# EAGLE design EVSE_Arduino_Shield (EAGLE 9.6.2)
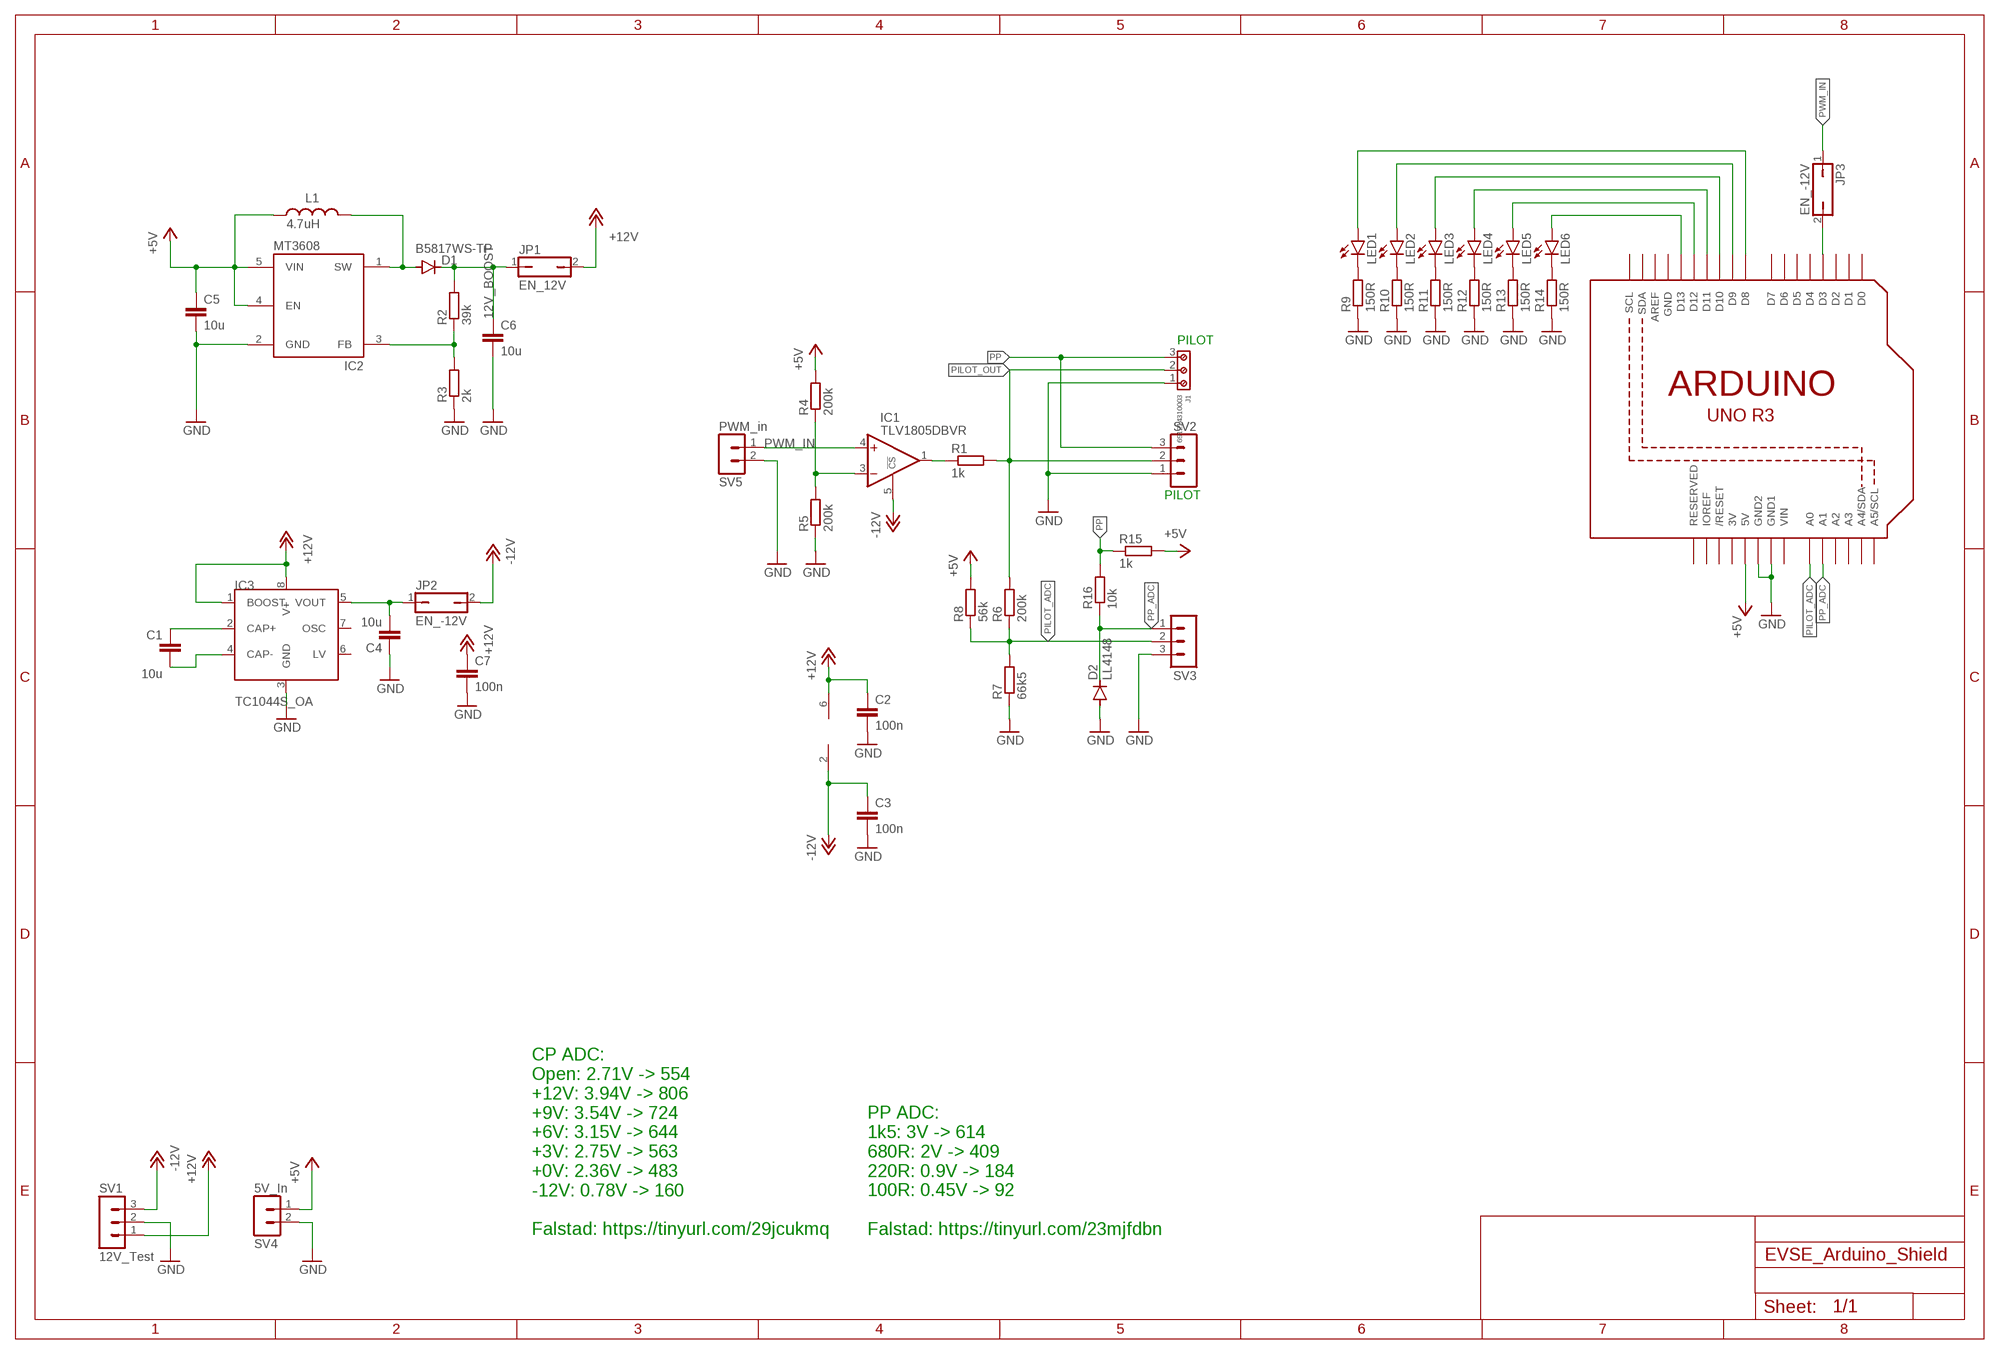
[diagram p0: schematic, sheet 1]

## Parts
C1  10u  C-EUC0805  [C0805]
C2  100n  C-EUC0603  [C0603]
C3  100n  C-EUC0603  [C0603]
C4  10u  C-EUC0805  [C0805]
C5  10u  C-EUC0805  [C0805]
C6  10u  C-EUC0805  [C0805]
C7  100n  C-EUC0603  [C0603]
D1  B5817WS-TP  DIODE-SOD323-R  [SOD323-R]
D2  LL4148  DIODE-SOD80C  [SOD80C]
IC1  TLV1805DBVR  [SOT23-6]
IC2  MT3608  [SOT23-6]
IC3  TC1044S_OA  [SO08]
J1  691214310003  [691214310003]
JP1  EN_12V  JP1Q  [JP1]
JP2  EN_-12V  JP1Q  [JP1]
JP3  EN_-12V  JP1Q  [JP1]
L1  4.7uH  WE-PMI_0805_74479775247_H1  [WE-PMI_0805_H1]
LED1  LEDCHIP-LED0603  [CHIP-LED0603]
LED2  LEDCHIP-LED0603  [CHIP-LED0603]
LED3  LEDCHIP-LED0603  [CHIP-LED0603]
LED4  LEDCHIP-LED0603  [CHIP-LED0603]
LED5  LEDCHIP-LED0603  [CHIP-LED0603]
LED6  LEDCHIP-LED0603  [CHIP-LED0603]
R1  1k  R-EU_R0805  [R0805]
R2  39k  R-EU_R0603  [R0603]
R3  2k  R-EU_R0603  [R0603]
R4  200k  R-EU_R0603  [R0603]
R5  200k  R-EU_R0603  [R0603]
R6  200k  R-EU_R0603  [R0603]
R7  66k5  R-EU_R0603  [R0603]
R8  56k  R-EU_R0603  [R0603]
R9  150R  R-EU_R0603  [R0603]
R10  150R  R-EU_R0603  [R0603]
R11  150R  R-EU_R0603  [R0603]
R12  150R  R-EU_R0603  [R0603]
R13  150R  R-EU_R0603  [R0603]
R14  150R  R-EU_R0603  [R0603]
R15  1k  R-EU_R0603  [R0603]
R16  10k  R-EU_R0603  [R0603]
SV1  12V_Test  MA03-1  [MA03-1]
SV2  MA03-1  [MA03-1]
SV3  MA03-1  [MA03-1]
SV4  5V_In  MA02-1  [MA02-1]
SV5  PWM_in  MA02-1  [MA02-1]
U2  ARDUINOR3-DIMENSION  [ARDUINOR3]

## Nets
12V_BOOST: C6.1 D1.C JP1.1 R2.2
+5V: C5.1 IC2.4(EN) IC2.5(VIN) L1.1 R4.2 R8.2 R15.2 SV4.1 U2.5V
+12V: C2.1 C7.1 IC1.6(V+) IC3.1(BOOST) IC3.8(V+) JP1.2 SV1.1
-12V: C3.1 IC1.2(V-) IC1.5(!CS) JP2.2 SV1.3
BOOST_SW: D1.A IC2.1(SW) L1.2
GND: C2.2 C3.2 C4.1 C5.2 C6.2 C7.2 D2.A IC2.2(GND) IC3.3(GND) J1.1 R3.1 R5.1 R7.1 R9.1 R10.1 R11.1 R12.1 R13.1 R14.1 SV1.2 SV2.1 SV3.3 SV4.2 SV5.2 U2.GND1 U2.GND2
N$1: LED1.C R9.2
N$2: LED2.C R10.2
N$3: IC2.3(FB) R2.1 R3.2
N$4: IC1.1(OUT) R1.1
N$5: JP3.2 U2.D3
N$6: LED3.C R11.2
N$7: C4.2 IC3.5(VOUT) JP2.1
N$8: IC1.3(-IN) R4.1 R5.2
N$9: LED4.C R12.2
N$10: LED5.C R13.2
N$11: C1.1 IC3.2(CAP+)
N$12: C1.2 IC3.4(CAP-)
N$13: LED6.C R14.2
N$14: LED6.A U2.D13
N$15: LED5.A U2.D12
N$16: LED4.A U2.D11
N$17: LED3.A U2.D10
N$18: LED2.A U2.D9
N$19: LED1.A U2.D8
PILOT_ADC: R6.1 R7.2 R8.1 SV3.2 U2.A0
PILOT_OUT: J1.2 R1.2 R6.2 SV2.2
PP: J1.3 R15.1 R16.2 SV2.3
PP_ADC: D2.C R16.1 SV3.1 U2.A1
PWM_IN: IC1.4(+IN) JP3.1 SV5.1
Unconnected: IC3.6(LV) IC3.7(OSC) U2.A2 U2.A3 U2.A4(A4/SDA) U2.A5(A5/SCL) U2.AREF U2.D0 U2.D1 U2.D2 U2.D4 U2.D5 U2.D6 U2.D7 U2.IOREF U2.RESERVED U2.RESET(/RESET) U2.SCL U2.SDA

## Notes on the sheet
- PILOT
- PILOT
- CP ADC:
  Open: 2.71V -> 554
  +12V: 3.94V -> 806
  +9V: 3.54V -> 724
  +6V: 3.15V -> 644
  +3V: 2.75V -> 563
  +0V: 2.36V -> 483
  -12V: 0.78V -> 160
  
  Falstad: https://tinyurl.com/29jcukmq
- PP ADC:
  1k5: 3V -> 614
  680R: 2V -> 409
  220R: 0.9V -> 184
  100R: 0.45V -> 92
  
  Falstad: https://tinyurl.com/23mjfdbn

## Power pins joined to a net without a drawn wire
3V: U2.3V
GND: U2.GND
VIN: U2.VIN

## Library data of the parts
C1-C7 = rcl:C-EU: CAPACITOR, European symbol; SPICEPREFIX: C
D1 D2 = diode:DIODE-: DIODE
IC1 = Eigene-Rietig:TLV1805DBVR
IC2 = Eigene-Rietig:MT3608
IC3 = TC1044S:TC1044S
J1 = Wurth_Connectors_WR-TBL Rising Cage Clamp:691214310003: WR-TBL Serie 2143 - 3.81 mm Horiz. Entry Modular KIND PROPERTIES Pitch 3.81 mm MATERIAL PROPERTIES Insulator Material PA66 Insulator Flammability Rating UL94 V-0 Insulator Color Green Contact Material Brass Contact Plating Copper over Zinc Terminal Screw Material Steel Terminal Screw Plating Zinc Wire Guard Material Brass GENERAL INFORMATION Operating Temperature -40 up to +105 °C Compliance Lead free / RoHS ELECTRICAL PROPERTIES IR cULus 10 A Working Voltage [cULus] 300 V (AC) Withstanding Voltage [cULus] 1600 V (AC) Contact Resistance [cULus] 20 mΩ MECHANICAL PROPERTIES Wire Strip Length 5 up to 6 (mm) Screw M2 Solid Wire Section (AWG) 24 to 16 (AWG) Solid Wire Section (Metric) 0.205 to 1.31 (mm²) Stranded Wire Section (AWG) 24 to 16 (AWG) Stranded Wire Section (Metric) 0.205 to 1.31 (mm²) CERTIFICATION cULus Approval E315414 PACKAGING PROPERTIES Packaging Box <https://katalog.we-online.com/media/images/v2/o33236v209%20Family_WR-TBL_69121431000x.jpg> Details see: https://katalog.we-online.com/en/em/TBL_3_81_2143_HORIZONTAL_ENTRY_MODULAR_69121431000X Updated by Ella Wu 2019-11-13 2019(C) Wurth Elektronik; DATASHEET-URL: https://www.we-online.com/redexpert/spec/691214310003?ae; IR-UL: 10A; MOUNT: THT; PART-NUMBER: 691214310003; PINS: 3; PITCH: 3.81mm; TYPE: Horizontal; WIRE: 24 to 16 (AWG) 0.205 to 1.31 (mm²); WORKING-VOLTAGE-UL: 300V (AC)
JP1-JP3 = jumper:JP1Q: JUMPER
L1 = Wurth_Power Magnetics_WE-PMI:WE-PMI_0805: WE-PMI Power Multilayer Inductor Shielded Characteristics Compact multilayer type Suitable for applications with high currents up to 2.7 A Smallest RDC-Values starting at 7 mΩ Magnetically shielded construction: No crosstalk Operating temperature: –40 °C to +125 °C Recommended soldering profile: Reflow 4 sizes and 3 different types available (Low Profile, Low RDC & High Saturation Current) Applications DC/DC converters especially at high switching frequencies > 1MHz Electronic devices with very low profile Portable devices like Smart Phones, Tablets, Notebooks and Digital Cameras <https://www.we-online.com/catalog/media/o14838v209%20Family_WE-PMI.jpg> Details see: https://www.we-online.com/katalog/en/WE-PMI Updated by Ella Wu 2020-12-17 2020 (C) Wurth Elektronik; DATASHEET-URL: https://www.we-online.com/catalog/datasheet/74479775247.pdf; FRES: 30MHz; H: 1mm; IR1: 600mA; IR2: 850mA; ISAT: 250mA; PART-NUMBER: 74479775247; RDC: 250mOhm; TYPE: Low RDC
LED1-LED6 = led:LED: LED OSRAM: - CHIPLED LG R971, LG N971, LY N971, LG Q971, LY Q971, LO R971, LY R971 LH N974, LH R974 LS Q976, LO Q976, LY Q976 LO Q996 - Hyper CHIPLED LW Q18S LB Q993, LB Q99A, LB R99A - SideLED LS A670, LO A670, LY A670, LG A670, LP A670 LB A673, LV A673, LT A673, LW A673 LH A674 LY A675 LS A676, LA A676, LO A676, LY A676, LW A676 LS A679, LY A679, LG A679 - Hyper Micro SIDELED® LS Y876, LA Y876, LO Y876, LY Y876 LT Y87S - SmartLED LW L88C, LW L88S LB L89C, LB L89S, LG L890 LS L89K, LO L89K, LY L89K LS L896, LA L896, LO L896, LY L896 - TOPLED LS T670, LO T670, LY T670, LG T670, LP T670 LSG T670, LSP T670, LSY T670, LOP T670, LYG T670 LG T671, LOG T671, LSG T671 LB T673, LV T673, LT T673, LW T673 LH T674 LS T676, LA T676, LO T676, LY T676, LB T676, LH T676, LSB T676, LW T676 LB T67C, LV T67C, LT T67C, LS T67K, LO T67K, LY T67K, LW E67C LS E67B, LA E67B, LO E67B, LY E67B, LB E67C, LV E67C, LT E67C LW T67C LS T679, LY T679, LG T679 LS T770, LO T770, LY T770, LG T770, LP T770 LB T773, LV T773, LT T773, LW T773 LH T774 LS E675, LA E675, LY E675, LS T675 LS T776, LA T776, LO T776, LY T776, LB T776 LHGB T686 LT T68C, LB T68C - Hyper Mini TOPLED® LB M676 - Mini TOPLED Santana® LG M470 LS M47K, LO M47K, LY M47K Source: http://www.osram.convergy.de LUXEON: - LUMILED® LXK2-PW12-R00, LXK2-PW12-S00, LXK2-PW14-U00, LXK2-PW14-V00 LXK2-PM12-R00, LXK2-PM12-S00, LXK2-PM14-U00 LXK2-PE12-Q00, LXK2-PE12-R00, LXK2-PE12-S00, LXK2-PE14-T00, LXK2-PE14-U00 LXK2-PB12-K00, LXK2-PB12-L00, LXK2-PB12-M00, LXK2-PB14-N00, LXK2-PB14-P00, LXK2-PB14-Q00 LXK2-PR12-L00, LXK2-PR12-M00, LXK2-PR14-Q00, LXK2-PR14-R00 LXK2-PD12-Q00, LXK2-PD12-R00, LXK2-PD12-S00 LXK2-PH12-R00, LXK2-PH12-S00 LXK2-PL12-P00, LXK2-PL12-Q00, LXK2-PL12-R00 Source: www.luxeon.com KINGBRIGHT: KA-3528ASYC Source: www.kingbright.com
R1-R16 = rcl:R-EU_: RESISTOR, European symbol; SPICEPREFIX: R
SV1-SV3 = con-lstb:MA03-1: PIN HEADER; OC_FARNELL: unknown; OC_NEWARK: unknown
SV4 SV5 = Eigene-Rietig:MA02-1: PIN HEADER; OC_FARNELL: unknown; OC_NEWARK: unknown
U2 = adafruit:ARDUINOR3: This is a new object for the new Arduino R3 - with extra pins that you may want to use (such as IOref, and duplicated A4/A5

## Net classes
1 power: width 0.406 mm

## Board
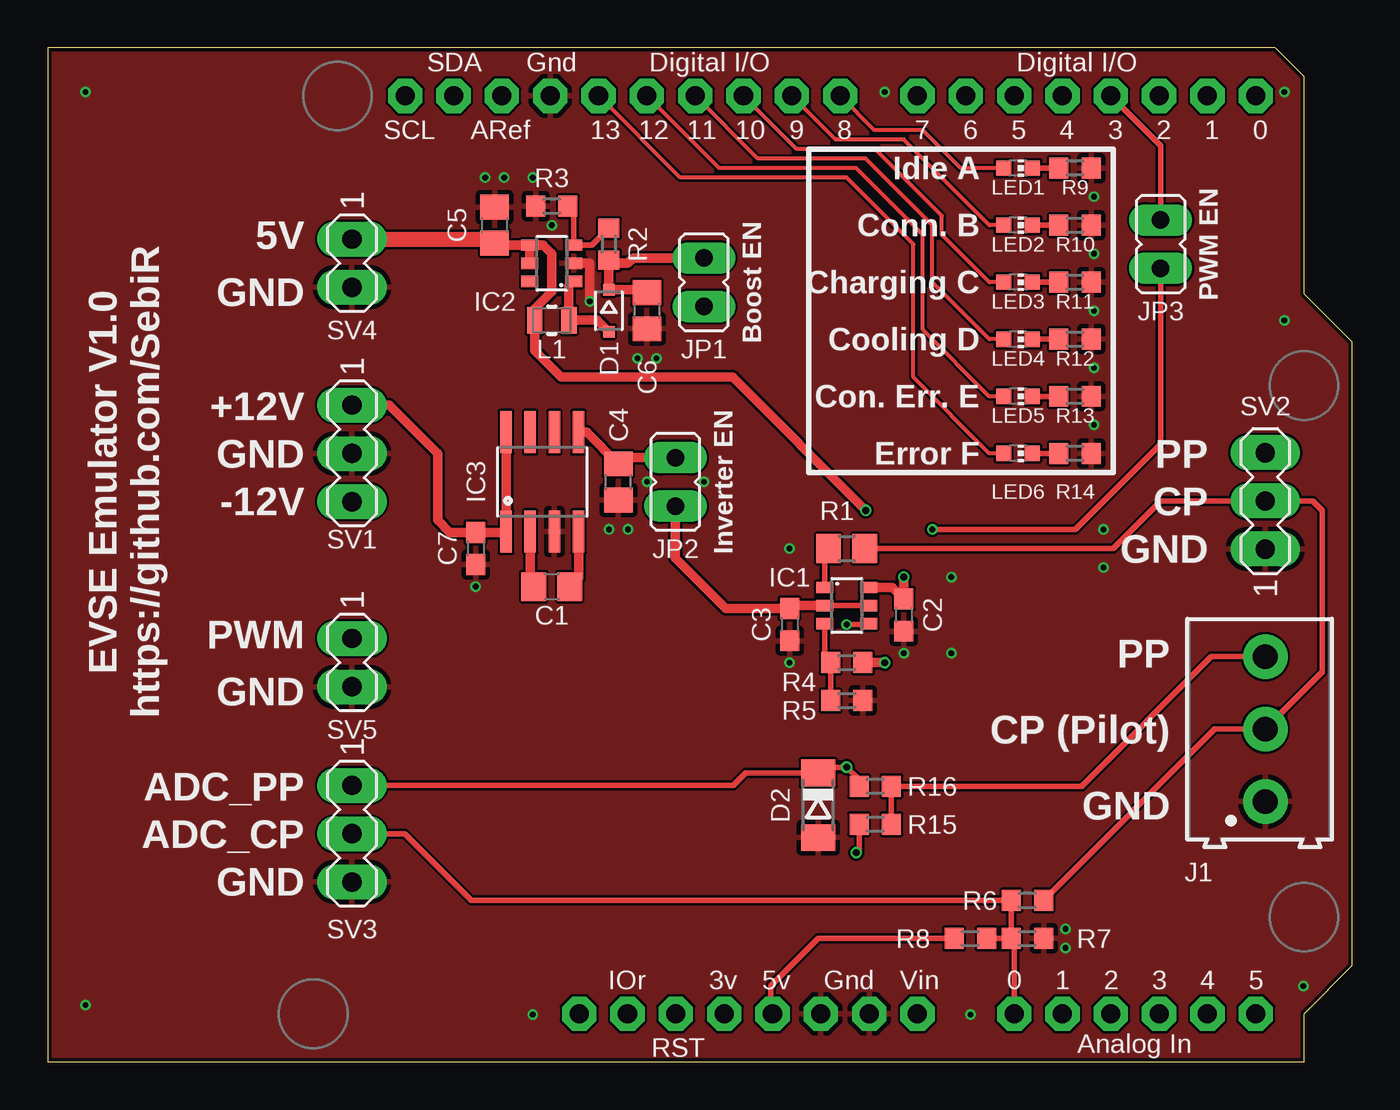
[diagram p1: board, top side]
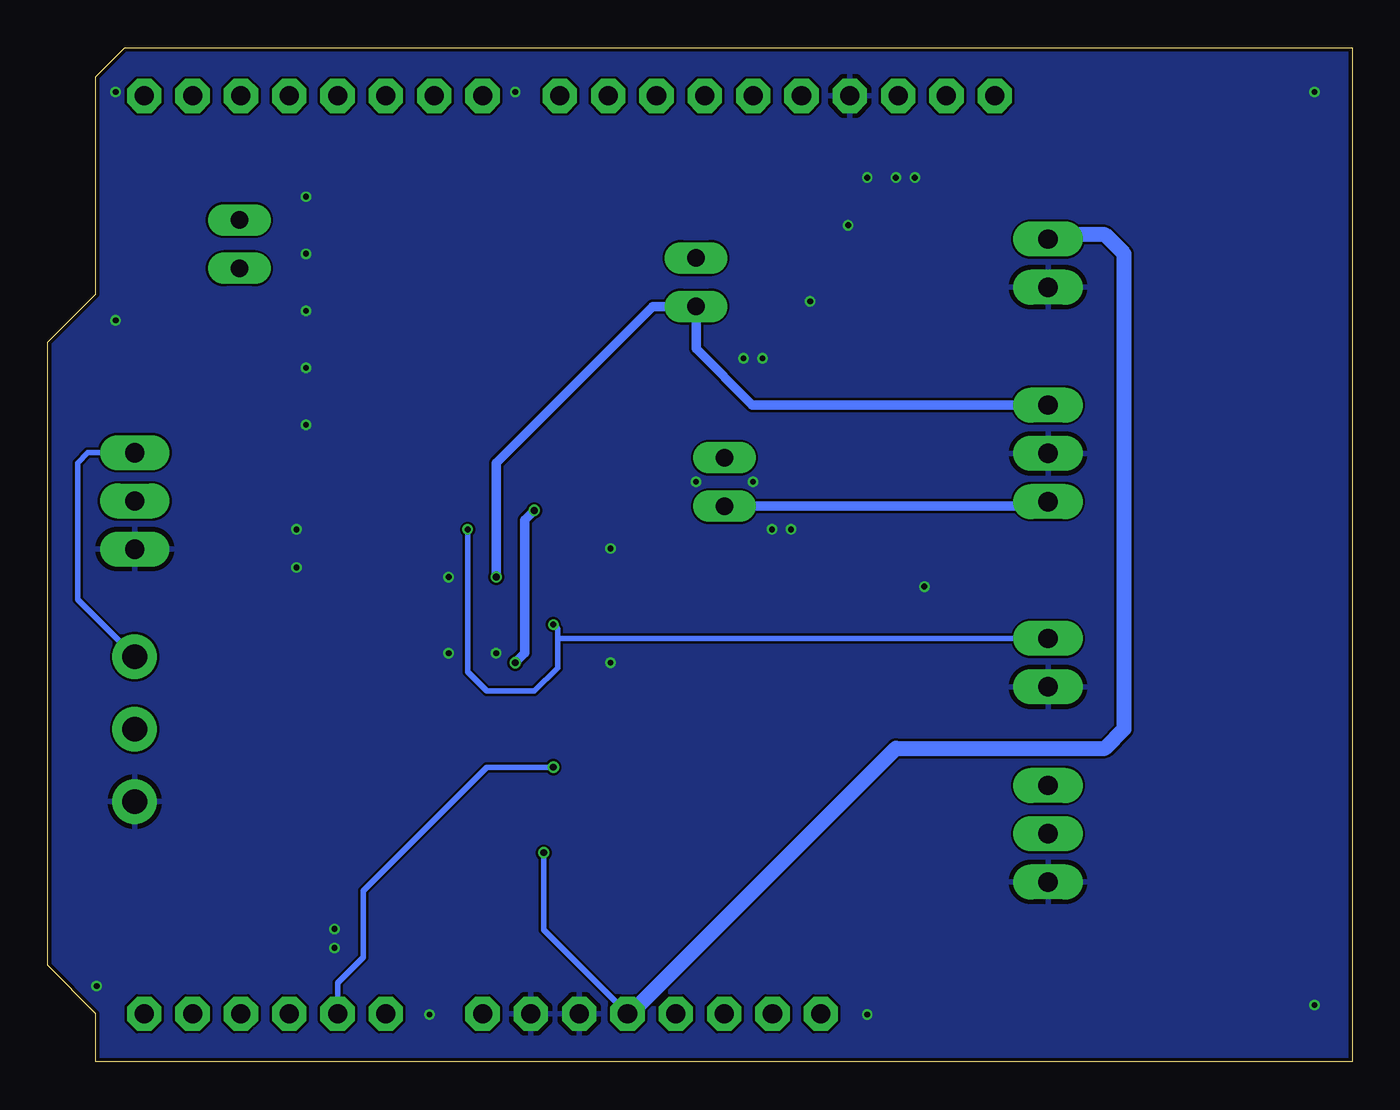
[diagram p2: board, bottom side, seen from below]

Size 68.58 x 53.34 mm. Coordinates in mm from the lower left corner, seen from the top.
Copper layers (1*16): Top 0.035mm / dielectric 1.6mm / Bottom 0.035mm
Design rules "jlcpcb-2layers": minimum track width 0.2mm, minimum drill 0.3mm, track to track 5mil, track to pad 5mil, pad to pad 5mil, via to via 5mil, smd to smd 5mil, copper to edge 0.2mm, drill to drill 6mil, minimum pad ring 10mil, minimum via ring 0.125mm, stop-mask expansion 4mil, vias tented up to drill 0.5mm, thermal gap 10mil

### Footprints (pad centres in the part's own frame; a part is rotated, then mirrored left to right if it is on the bottom)
C0805 = smd 1.3 x 1.5: 1 -0.95,0; 2 0.95,0
C0603 = smd 1.1 x 1: 1 -0.85,0; 2 0.85,0
SOD323-R = smd 0.6 x 0.6: A 1.1,0; C -1.1,0
SOD80C = smd 1.4 x 1.8: A 1.7,0; C -1.7,0
SOT23-6 = smd 0.6 x 0.9: 1 -0.95,-1.15; 2 0,-1.15; 3 0.95,-1.15; 4 0.95,1.15; 5 0,1.15; 6 -0.95,1.15
SO08 = smd 0.61 x 2.21: 1 -1.905,-2.616; 2 -0.635,-2.616; 3 0.635,-2.616; 4 1.905,-2.616; 5 1.905,2.616; 6 0.635,2.616; 7 -0.635,2.616; 8 -1.905,2.616
691214310003 = drill 1.3: 1 -3.81,0; 2 0,0; 3 3.81,0
JP1 = drill 0.914 long: 1 0,-1.27; 2 0,1.27
WE-PMI_0805_H1 = smd 0.8 x 1.4: 1 -0.9,0; 2 0.9,0
CHIP-LED0603 = smd 0.8 x 0.8: A 0,-0.75; C 0,0.75
R0805 = smd 1.3 x 1.5: 1 -0.95,0; 2 0.95,0
R0603 = smd 1 x 1.1: 1 -0.85,0; 2 0.85,0
MA03-1 = drill 1.016 long: 1 -2.54,0; 2 0,0; 3 2.54,0
MA02-1 = drill 1.016 long: 1 -1.27,0; 2 1.27,0
ARDUINOR3 = drill 1 pad 1.676 octagon: 3V 35.56,2.54; 5V 38.1,2.54; A0 50.8,2.54; A1 53.34,2.54; A2 55.88,2.54; A3 58.42,2.54; A4 60.96,2.54; A5 63.5,2.54; AREF 23.876,50.8; D0 63.5,50.8; D1 60.96,50.8; D2 58.42,50.8; D3 55.88,50.8; D4 53.34,50.8; D5 50.8,50.8; D6 48.26,50.8; D7 45.72,50.8; D8 41.656,50.8; D9 39.116,50.8; D10 36.576,50.8; D11 34.036,50.8; D12 31.496,50.8; D13 28.956,50.8; GND 26.416,50.8; GND1 43.18,2.54; GND2 40.64,2.54; IOREF 30.48,2.54; RESERVED 27.94,2.54; RESET 33.02,2.54; SCL 18.796,50.8; SDA 21.336,50.8; VIN 45.72,2.54

### Placement (x,y rotation side)
C1  26.5,25 0 top
C2  45,23.5 270 top
C3  39,23 270 top
C4  30,30.5 90 top
C5  23.5,44 90 top
C6  31.5,39.5 270 top
C7  22.5,27 270 top
D1  29.5,39.5 270 top
D2  40.5,13.5 270 top
IC1  42,24 270 top
IC2  26.5,42 90 top
IC3  26,30.5 0 top
J1  64,17.5 90 top
JP1  34.5,41 180 top
JP2  33,30.5 180 top
JP3  58.5,43 0 top
L1  26.5,39 0 top
LED1  51,47 270 top
LED2  51,44 270 top
LED3  51,41 270 top
LED4  51,38 270 top
LED5  51,35 270 top
LED6  51,32 270 top
R1  42,27 0 top
R2  29.5,43 270 top
R3  26.5,45 0 top
R4  42,21 0 top
R5  42,19 180 top
R6  51.5,8.5 0 top
R7  51.5,6.5 180 top
R8  48.5,6.5 180 top
R9  54,47 180 top
R10  54,44 180 top
R11  54,41 180 top
R12  54,38 180 top
R13  54,35 180 top
R14  54,32 180 top
R15  43.5,12.5 180 top
R16  43.5,14.5 0 top
SV1  16,32 270 top
SV2  64,29.5 90 top
SV3  16,12 270 top
SV4  16,42 270 top
SV5  16,21 270 top
U2  0,0 0 top

### Tracks (layer width: path | path; a pad name or v marks a point on that pad's centre or on a via)
12V_BOOST
  Top 0.406: R2.2 29.65,42
  Top 0.5: R2.2 D1.C 31.35,40.6 C6.1 | 29.65,42 30.5,42 30.77,42.27 JP1.1
+5V  (via drill 0.35)
  Top 0.3: R8.2 40.5,6.5 38,4 38,2.64 U2.5V | R15.2 42.65,11.15 v42.5,11
  Top 0.5: 23.28,43.27 C5.1 23.6,42.95 IC2.4 | IC2.4 26.05,42.95 26.5,42.5 26.5,40.5 25.5,39.5 25.5,39.1 L1.1 25.6,37.4 27,36 36,36 v43,29 | v44,21 R4.2 | IC2.5 IC2.4
  Top 0.8: SV4.1 23.28,43.27
  Bottom 0.3: v42.5,11 42.5,6.94 U2.5V
  Bottom 0.5: v43,29 43.5,28.5 43.5,21.5 v44,21
  Bottom 0.8: U2.5V 37.96,2.54 24,16.5 13,16.5 12,17.5 12,42.5 13,43.5 15.77,43.5 SV4.1
+12V  (via drill 0.35)
  Top 0.5: IC3.8 IC3.1 24.06,27.85 C7.1 21.15,27.85 20.5,28.5 20.5,32 17.96,34.54 SV1.1 | IC1.6 44.4,24.95 C2.1 v45,25.5
  Bottom 0.5: SV1.1 31.54,34.54 34.5,37.5 JP1.2 36.77,39.73 45,31.5 v45,25.5
-12V
  Top 0.3: IC1.2 IC1.5
  Top 0.5: JP2.2 33,26.5 35.65,23.85 C3.1 39.15,24 IC1.2
  Bottom 0.5: JP2.2 16.23,29.23 SV1.3
BOOST_SW
  Top 0.5: IC2.1 27.4,40.8 L1.2 28.9,39 D1.A
GND  (via drill 0.3)
  Top 0.5: IC2.2 28.5,42 v28.5,40
  other vias: 2,51 2,3 66,4 65,39 65,51 44,51 31,37 32,37 23,46.5 24,46.5 25.5,46.5 26.5,44 22.5,25 29.5,28 30.5,28 39,21 45,21.5 47.5,25.5 47.5,21.5 55.5,28 55.5,26 55,42.5 55,39.5 34.5,30.5 31.5,30.5 48.5,2.5 25.5,2.5 53.5,7 53.5,6 55,45.5 55,36.5 55,33.5 39,27
  pour Top: 0,0 0,53.5 64.5,53.5 66,52 66,40.5 68.5,38 68.5,5 66,2.5 66,0
  pour Bottom: 0,0 66,0 66,2.5 68.5,5 68.5,38 66,40.5 66,52 64.5,53.5 0,53.5
N$1
  Top 0.3: LED1.C R9.2
N$2
  Top 0.3: LED2.C R10.2
N$3
  Top 0.2: R3.2 27.65,44.7
  Top 0.3: 27.65,44.7 IC2.3 28.6,42.95 R2.1
N$4
  Top 0.3: IC1.1 40.85,26.8
  Top 0.5: 40.85,26.8 R1.1
N$5
  Top 0.3: 58.42,44.35 JP3.2 58.5,48.18 U2.D3
N$6
  Top 0.3: LED3.C R11.2
N$7
  Top 0.5: IC3.5 28.33,33.12 C4.2 30.32,31.77 JP2.1
N$8
  Top 0.3: R5.2 R4.1 40.85,21.3 IC1.3
N$9
  Top 0.3: LED4.C R12.2
N$10
  Top 0.3: LED5.C R13.2
N$11
  Top 0.5: IC3.2 25.36,25.18 C1.1
N$12
  Top 0.5: IC3.4 27.91,25.45 C1.2
N$13
  Top 0.3: LED6.C R14.2
N$14
  Top 0.2: LED6.A 49.5,32 45.5,36 45.5,43 42,46.5 33.26,46.5 U2.D13
N$15
  Top 0.2: LED5.A 49.5,35 46,38.5 46,43.5 42.5,47 35.3,47 U2.D12
N$16
  Top 0.2: LED4.A 49.5,38 46.5,41 46.5,44 43,47.5 37.34,47.5 U2.D11
N$17
  Top 0.2: LED3.A 49.5,41 47,43.5 47,44.5 43.5,48 39.38,48 U2.D10
N$18
  Top 0.2: LED2.A 49.5,44 45,48.5 41.42,48.5 U2.D9
N$19
  Top 0.2: LED1.A 48,47 46,49 43.46,49 U2.D8
PILOT_ADC
  Top 0.3: U2.A0 50.8,6.35 R7.2 | R7.2 R6.1 22.27,8.5 18.77,12 SV3.2 | R8.1 R7.2
PILOT_OUT
  Top 0.3: R1.2 56,27 58.5,29.5 SV2.2 66.5,29.5 67,29 67,20.5 J1.2 61.35,17.5 R6.2
PP
  Top 0.3: R15.1 R16.2 54.35,14.5 61.16,21.31 J1.3
  Bottom 0.3: J1.3 67,24.31 67,31.5 66.46,32.04 SV2.3
PP_ADC  (via drill 0.35)
  Top 0.3: R16.1 42.65,14.85 v42,15.5 40.8,15.5 D2.C 36.7,15.2 36.04,14.54 SV3.1
  Bottom 0.3: U2.A1 53.34,4.16 52,5.5 52,9 45.5,15.5 v42,15.5
PWM_IN  (via drill 0.3)
  Top 0.3: IC1.4 43.1,23 v42,23 | v46.5,28 54,28 58.5,32.5 JP3.1
  Bottom 0.3: v42,23 41.77,22.77 41.77,22.27 | 41.77,22.27 SV5.1 | v46.5,28 46.5,20.5 45.5,19.5 43,19.5 41.77,20.73 41.77,22.27

### Text on the board
tPlace: Idle A | 5V | Conn. B | PWM EN | Boost EN | Charging C | GND | Cooling D | Con. Err. E | +12V | GND | Error F | PP | EVSE Emulator V1.0 / https://github.com/SebiR | -12V | Inverter EN | CP | GND | PWM | PP | GND | CP (Pilot) | ADC_PP | GND | ADC_CP | GND